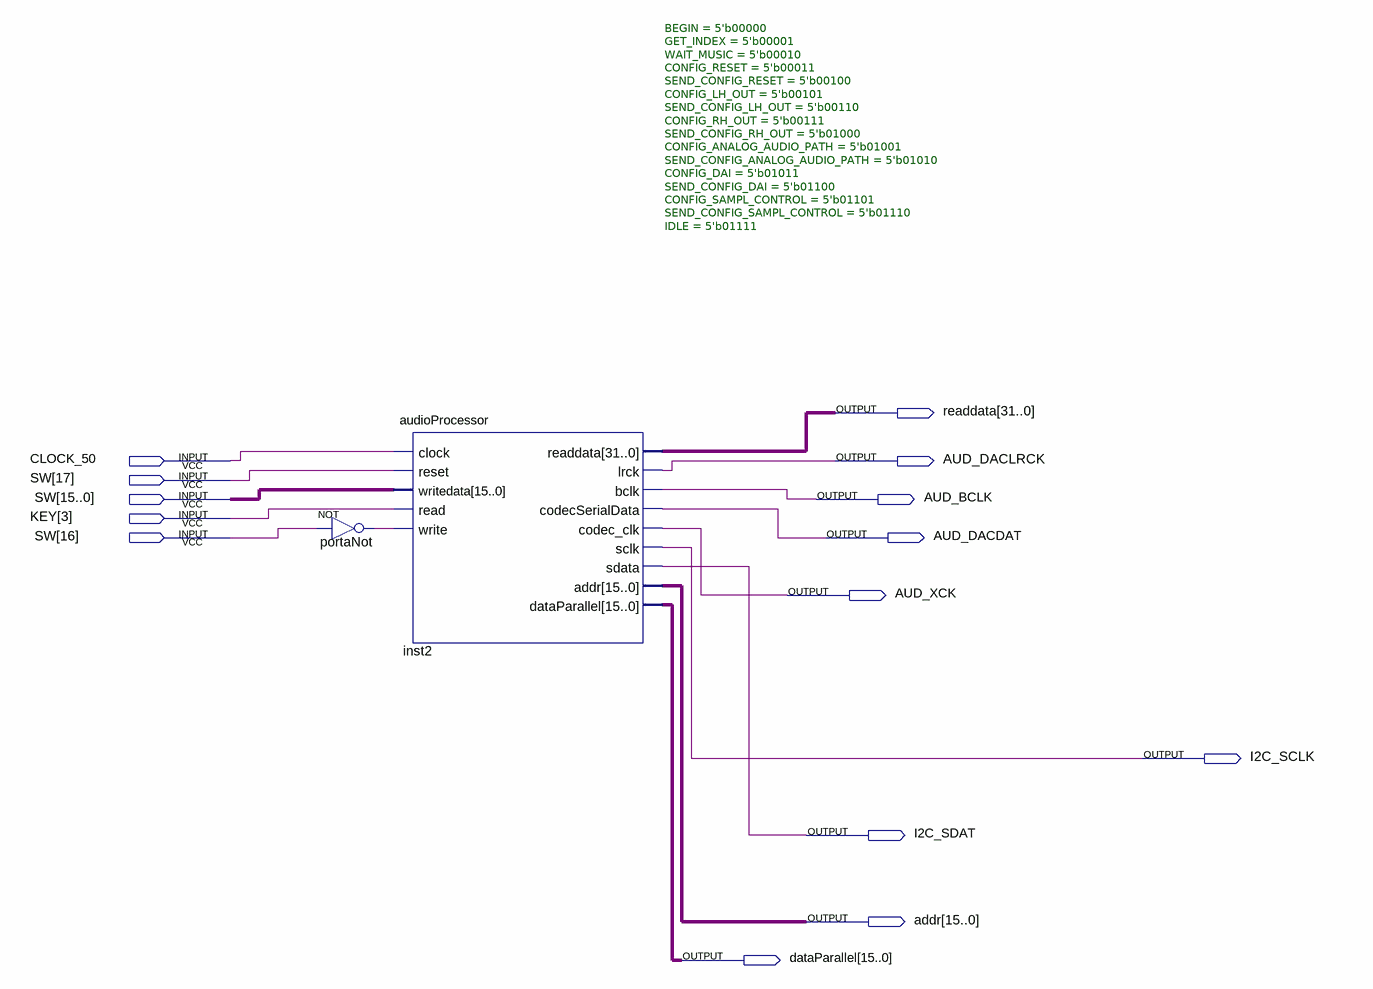
[diagram p0: schematic sheet]
// Quartus schematic AudioPin.bdf as structural Verilog: 2 symbols, 14 pins
module AudioPin (
  input  CLOCK_50,
  input  [17:0] SW,
  input  [3:3] KEY,
  output [31:0] readdata,
  output AUD_DACLRCK,
  output AUD_BCLK,
  output AUD_DACDAT,
  output AUD_XCK,
  output I2C_SCLK,
  output I2C_SDAT,
  output [15:0] addr,
  output [15:0] dataParallel
);

  wire portaNot_out;

  not portaNot (portaNot_out, SW[16]);
  audioProcessor #(.BEGIN(5'b00000), .GET_INDEX(5'b00001), .WAIT_MUSIC(5'b00010), .CONFIG_RESET(5'b00011), .SEND_CONFIG_RESET(5'b00100), .CONFIG_LH_OUT(5'b00101), .SEND_CONFIG_LH_OUT(5'b00110), .CONFIG_RH_OUT(5'b00111), .SEND_CONFIG_RH_OUT(5'b01000), .CONFIG_ANALOG_AUDIO_PATH(5'b01001), .SEND_CONFIG_ANALOG_AUDIO_PATH(5'b01010), .CONFIG_DAI(5'b01011), .SEND_CONFIG_DAI(5'b01100), .CONFIG_SAMPL_CONTROL(5'b01101), .SEND_CONFIG_SAMPL_CONTROL(5'b01110), .IDLE(5'b01111)) inst2 (
    .clock(CLOCK_50), .reset(SW[17]), .writedata(SW[15:0]), .read(KEY[3]), .write(portaNot_out),
    .readdata(readdata), .lrck(AUD_DACLRCK), .bclk(AUD_BCLK), .codecSerialData(AUD_DACDAT),
    .codec_clk(AUD_XCK), .sclk(I2C_SCLK), .sdata(I2C_SDAT), .addr(addr), .dataParallel(dataParallel));
endmodule
